# EAGLE design Electronic DC Load (EAGLE 8.3.2)
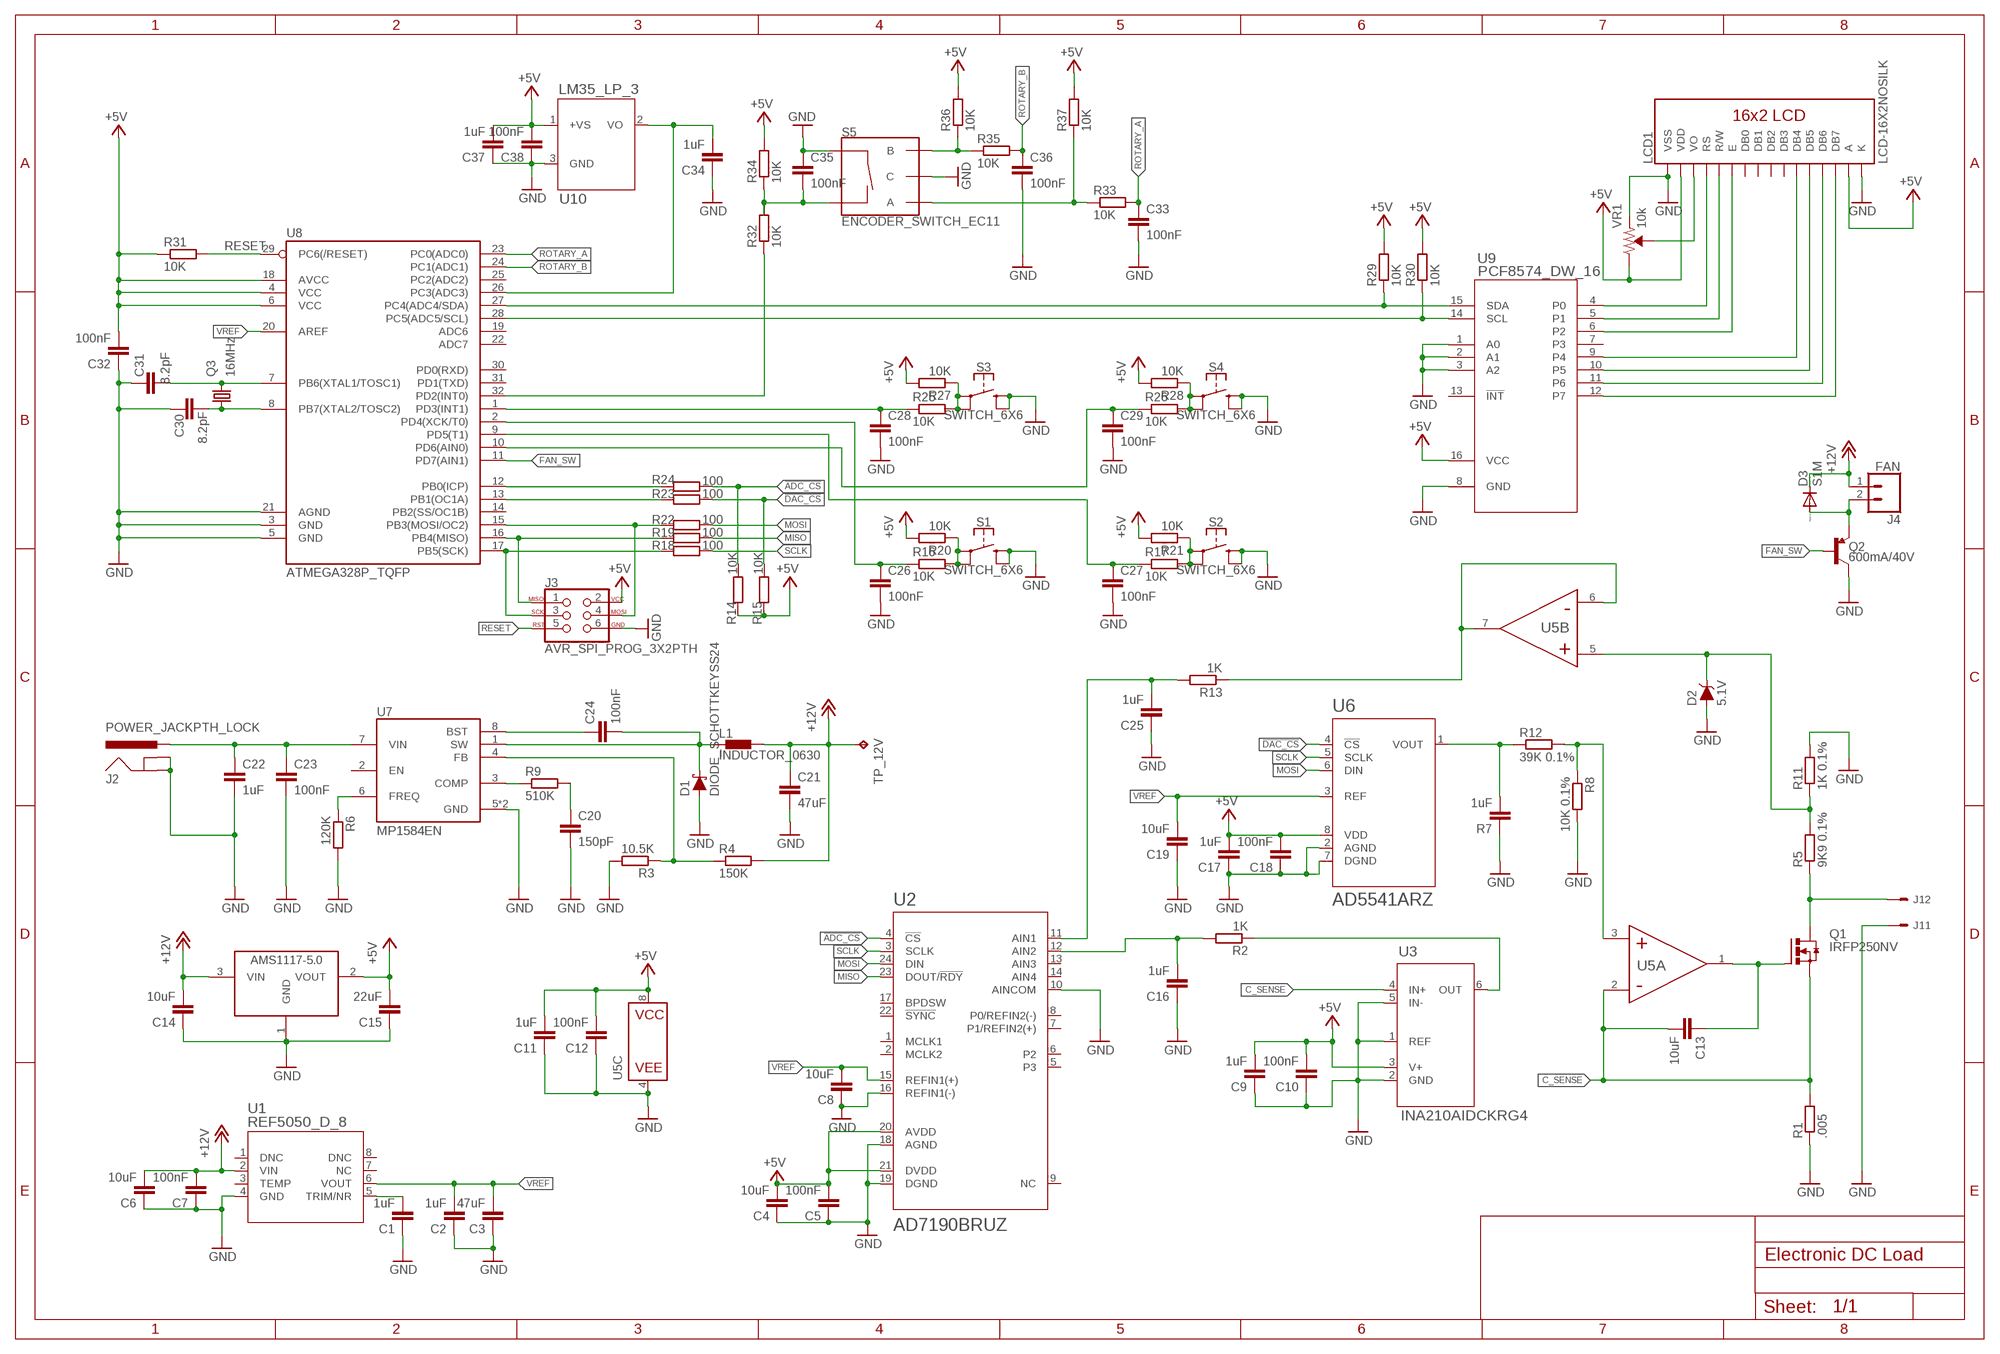
[diagram p0: schematic, sheet 1]

## Parts
C1  1uF  C-EUC0805  [C0805]
C2  1uF  C-EUC0805  [C0805]
C3  47uF  C-EUC1206  [C1206]
C4  10uF  C-EUC1206  [C1206]
C5  100nF  C-EUC0805  [C0805]
C6  10uF  C-EUC1206  [C1206]
C7  100nF  C-EUC0805  [C0805]
C8  10uF  C-EUC1206  [C1206]
C9  1uF  C-EUC0805  [C0805]
C10  100nF  C-EUC0805  [C0805]
C11  1uF  C-EUC0805  [C0805]
C12  100nF  C-EUC0805  [C0805]
C13  10uF  C-EUC1206  [C1206]
C14  10uF  C-EUC1206  [C1206]
C15  22uF  C-EUC1206  [C1206]
C16  1uF  C-EUC0805  [C0805]
C17  1uF  C-EUC0805  [C0805]
C18  100nF  C-EUC0805  [C0805]
C19  10uF  C-EUC1206  [C1206]
C20  150pF  C-EUC0402  [C0402]
C21  47uF  C-EUC1206  [C1206]
C22  1uF  C-EUC0805  [C0805]
C23  100nF  C-EUC0805  [C0805]
C24  100nF  C-EUC0805  [C0805]
C25  1uF  C-EUC0805  [C0805]
C26  100nF  C-EUC0603  [C0603]
C27  100nF  C-EUC0603  [C0603]
C28  100nF  C-EUC0603  [C0603]
C29  100nF  C-EUC0603  [C0603]
C30  8.2pF  C-EUC0603  [C0603]
C31  8.2pF  C-EUC0603  [C0603]
C32  100nF  C-EUC0603  [C0603]
C33  100nF  C-EUC0603  [C0603]
C34  1uF  C-EUC0805  [C0805]
C35  100nF  C-EUC0603  [C0603]
C36  100nF  C-EUC0603  [C0603]
C37  1uF  C-EUC0805  [C0805]
C38  100nF  C-EUC0805  [C0805]
D1  DIODE_SCHOTTKEYSS24  [SMA-DIODE]
D2  5.1V  DIODE-ZENER-ZMM5.1  [LL-34]
D3  S1M  [SMA]
J1  KF762-2  [KF762-2]
J2  POWER_JACKPTH_LOCK  [POWER_JACK_PTH_LOCK]
J3  AVR_SPI_PROG_3X2PTH  [2X3]
J4  FAN  CONN_02LOCK_LONGPADS  [1X02_LOCK_LONGPADS]
L1  INDUCTOR_0630  [INDUCTOR_0630]
LCD1  LCD-16X2NOSILK  [LCD-16X2_NOSILK]
Q1  IRFP250NV  [TO247BV]
Q2  600mA/40V  TRANS_PNP-MMBT4403  [SOT23-3]
Q3  16MHz  KX-7  [3.2X2.5_KX-7]
R1  .005  MRE_R005_4W_2728_1%  [2728]
R2  1K  R-EU_R0805  [R0805]
R3  10.5K  R-EU_R0603  [R0603]
R4  150K  R-EU_R0603  [R0603]
R5  9K9 0.1%  R-EU_M0805  [M0805]
R6  120K  R-EU_R0603  [R0603]
R7  1uF  C-EUC0805  [C0805]
R8  10K 0.1%  R-EU_R0805  [R0805]
R9  510K  R-EU_R0603  [R0603]
R11  1K 0.1%  R-EU_M0805  [M0805]
R12  39K 0.1%  R-EU_R0805  [R0805]
R13  1K  R-EU_R0805  [R0805]
R14  10K  R-EU_M0805  [M0805]
R15  10K  R-EU_M0805  [M0805]
R16  10K  R-EU_R0603  [R0603]
R17  10K  R-EU_R0603  [R0603]
R18  100  R-EU_M0805  [M0805]
R19  100  R-EU_M0805  [M0805]
R20  10K  R-EU_R0603  [R0603]
R21  10K  R-EU_R0603  [R0603]
R22  100  R-EU_M0805  [M0805]
R23  100  R-EU_M0805  [M0805]
R24  100  R-EU_M0805  [M0805]
R25  10K  R-EU_R0603  [R0603]
R26  10K  R-EU_R0603  [R0603]
R27  10K  R-EU_R0603  [R0603]
R28  10K  R-EU_R0603  [R0603]
R29  10K  R-EU_R0603  [R0603]
R30  10K  R-EU_R0603  [R0603]
R31  10K  R-EU_R0603  [R0603]
R32  10K  R-EU_R0603  [R0603]
R33  10K  R-EU_R0603  [R0603]
R34  10K  R-EU_R0603  [R0603]
R35  10K  R-EU_R0603  [R0603]
R36  10K  R-EU_R0603  [R0603]
R37  10K  R-EU_R0603  [R0603]
S1  SWITCH_6X6  [SWITCH_SMD_6MM]
S2  SWITCH_6X6  [SWITCH_SMD_6MM]
S3  SWITCH_6X6  [SWITCH_SMD_6MM]
S4  SWITCH_6X6  [SWITCH_SMD_6MM]
S5  ENCODER_SWITCH_EC11  [ROTARY_ENCODER_EC11]
TP_12V  TPB1,27  [B1,27]
U1  REF5050_D_8  [D8]
U2  AD7190BRUZ  [RU_24]
U3  INA210AIDCKRG4  [DCK0006A_N]
U4  AMS1117-5.0  [SOT223]
U5  AD8629ARZ  [R_8]
U6  AD5541ARZ  [R_8]
U7  MP1584EN  [SOIC9P127_490X600X170L84X42T330X241N]
U8  ATMEGA328P_TQFP  [TQFP32-08]
U9  PCF8574_DW_16  [DW16]
U10  LM35_LP_3  [Z03A]
VR1  10k  TRIMPOT-SMD-3MM-OPEN-1/10W-25%  [TRIMPOT-SMD-TC33X]

## Nets
!ADC_CS: R14.2 R24.2 U2.4(!CS)
!DAC_CS: R15.2 R23.2 U6.4(!CS)
+5V [sup]: C4.2 C5.2 C9.2 C10.2 C11.2 C12.2 C15.2 C17.2 C18.2 C32.2 C37.2 C38.2 J3.2 LCD1.2(VDD) LCD1.15(A) R14.1 R15.1 R20.2 R21.2 R27.2 R28.2 R29.2 R30.2 R31.1 R34.2 R36.2 R37.2 U2.20(AVDD) U2.21(DVDD) U3.3(V+) U4.2(VOUT) U5.8(C:VCC) U6.8(VDD) U8.4(VCC) U8.6(VCC) U8.18(AVCC) U9.16(VCC) U10.1(+VS) VR1.1(CW)
+12V: C6.2 C7.2 C14.2 C21.1 D3.C J4.1 L1.P$2 R4.2 TP_12V.TP U1.2(VIN) U4.3(VIN)
C_SENSE [discharge]: C13.2 Q1.S R1.2 U3.4(IN+) U5.2(A:IN-)
FAN_SW: Q2.1(B) U8.11(PD7(AIN1))
GND: C1.1 C2.1 C3.1 C4.1 C5.1 C6.1 C7.1 C8.1 C9.1 C10.1 C11.1 C12.1 C14.1 C15.1 C16.1 C17.1 C18.1 C19.1 C20.2 C21.2 C22.2 C23.2 C25.1 C26.2 C27.2 C28.2 C29.2 C30.1 C31.1 C32.1 C33.2 C34.1 C35.1 C36.2 C37.1 C38.1 D1.A D2.A J1.1 J2.GND J2.GNDBREAK J3.6 LCD1.1(VSS) LCD1.16(K) Q2.3(C) R1.1 R3.2 R6.2 R7.1 R8.2 R11.2 S1.B1 S1.B2 S2.B1 S2.B2 S3.B1 S3.B2 S4.B1 S4.B2 S5.C S5.D(SW+) U1.4(GND) U2.10(AINCOM) U2.16(REFIN1(-)) U2.18(AGND) U2.19(DGND) U3.1(REF) U3.2(GND) U3.5(IN-) U4.1(GND) U5.4(C:VEE) U6.2(AGND) U6.7(DGND) U7.5(GND) U7.9(GND) U8.3(GND) U8.5(GND) U8.21(AGND) U9.1(A0) U9.2(A1) U9.3(A2) U9.8(GND) U10.3(GND) VR1.3(CCW)
MISO: R19.2 U2.23(DOUT/!RDY)
MOSI: R22.2 U2.24(DIN) U6.6(DIN)
N$1: R29.1 U8.27(PC4(ADC4/SDA)) U9.15(SDA)
N$2: R30.1 U8.28(PC5(ADC5/SCL)) U9.14(SCL)
N$3: LCD1.11(DB4) U9.9(P4)
N$4: LCD1.12(DB5) U9.10(P5)
N$5: LCD1.13(DB6) U9.11(P6)
N$6: LCD1.14(DB7) U9.12(P7)
N$7: LCD1.4(RS) U9.4(P0)
N$8: LCD1.5(R/W) U9.5(P1)
N$9: LCD1.6(E) U9.6(P2)
N$10: C1.2 U1.5(TRIM/NR)
N$11: C31.2 Q3.3 U8.7(PB6(XTAL1/TOSC1))
N$12: C30.2 Q3.1 U8.8(PB7(XTAL2/TOSC2))
N$13: LCD1.3(VO) VR1.2(WIPER)
N$14 [discharge]: J1.2 Q1.D R5.1
N$15: C34.2 U8.26(PC3(ADC3)) U10.2(VO)
N$16: C25.2 R13.2 U2.11(AIN1)
N$17: R6.1 U7.6(FREQ)
N$18: R2.1 U3.6(OUT)
N$19: C24.1 U7.8(BST)
N$20: C22.1 C23.1 J2.PWR U7.7(VIN)
N$21: C24.2 D1.C L1.P$1 U7.1(SW)
N$22: R3.1 R4.1 U7.4(FB)
N$23: R9.1 U7.3(COMP)
N$24: C16.2 R2.2 U2.12(AIN2)
N$25: C20.1 R9.2
N$26: R7.2 R12.1 U6.1(VOUT)
N$27: R13.1 U5.6(B:IN-) U5.7(B:OUT)
N$28: D3.A J4.2 Q2.2(E)
N$29: R35.1 R36.1 S5.B
N$30: J3.3 R18.1 U8.17(PB5(SCK))
N$31: J3.1 R19.1 U8.16(PB4(MISO))
N$32: J3.4 R22.1 U8.15(PB3(MOSI/OC2))
N$34: R23.1 U8.13(PB1(OC1A))
N$35: R24.1 U8.12(PB0(ICP))
N$36: C13.1 Q1.G U5.1(A:OUT)
N$37: D2.C R5.2 R11.1 U5.5(B:IN+)
N$38: R33.1 R37.1 S5.A
N$39: R8.1 R12.2 U5.3(A:IN+)
N$40: R16.2 R20.1 S1.A1 S1.A2
N$41: R25.2 R27.1 S3.A1 S3.A2
N$42: C35.2 R32.2 R34.1 S5.E(SW-)
N$43: C26.1 R16.1 U8.2(PD4(XCK/T0))
N$44: R32.1 U8.32(PD2(INT0))
N$46: C28.1 R25.1 U8.1(PD3(INT1))
N$48: R26.2 R28.1 S4.A1 S4.A2
N$51: R17.2 R21.1 S2.A1 S2.A2
N$52: C27.1 R17.1 U8.9(PD5(T1))
N$55: C29.1 R26.1 U8.10(PD6(AIN0))
RESET: J3.5 R31.2 U8.29(PC6(/RESET))
ROTARY_A: C33.1 R33.2 U8.23(PC0(ADC0))
ROTARY_B: C36.1 R35.2 U8.24(PC1(ADC1))
SCLK: R18.2 U2.3(SCLK) U6.5(SCLK)
VREF [sup]: C2.2 C3.2 C8.2 C19.2 U1.6(VOUT) U2.15(REFIN1(+)) U6.3(REF) U8.20(AREF)
Unconnected: LCD1.7(DB0) LCD1.8(DB1) LCD1.9(DB2) LCD1.10(DB3) U1.1(DNC) U1.3(TEMP) U1.7(NC) U1.8(DNC) U2.1(MCLK1) U2.2(MCLK2) U2.5(P3) U2.6(P2) U2.7(P1/REFIN2(+)) U2.8(P0/REFIN2(-)) U2.9(NC) U2.13(AIN3) U2.14(AIN4) U2.17(BPDSW) U2.22(!SYNC) U7.2(EN) U8.14(PB2(SS/OC1B)) U8.19(ADC6) U8.22(ADC7) U8.25(PC2(ADC2)) U8.30(PD0(RXD)) U8.31(PD1(TXD)) U9.7(P3) U9.13(!INT)

## Library data of the parts
C1-C38 R7 = resistor:C-EU: CAPACITOR, European symbol
D1 = 0_discrete:DIODE_SCHOTTKEY
D2 = 0_discrete:DIODE-ZENER: Zener Diode A Zener diode allows current to flow from its anode to its cathode like a normal semiconductor diode, but it also permits current to flow in the reverse direction when its "Zener voltage" is reached. - WIkipedia
D3 = diode:S1M
J1 = 0_discrete:KF762-2
J2 = SparkFun-Connectors:POWER_JACK: Power Jack Connector This is the standard 5.5mm barrel jack for power. The PTH is the most common, proven, reliable, footprint. The Slot footprint only works if the mill layer is transmitted to the PCB fab house so be warned. Here are the connectors we sell at SparkFun: DC Barrel Power Jack/Connector (PRT-00119) DC Barrel Power Jack/Connector (SMD) (PRT-12748) DC Barrel Jack Adapter - Breadboard Compatible (PRT-10811) It is used on this SparkFun product (and many, many others): SparkFun RedBoard - Programmed with Arduino (DEV-12757) Also, if you need a mating power supply or connector, please check these out: Wall Adapter Power Supply - 9VDC 650mA (TOL-00298) DC Barrel Jack Adapter - Male (PRT-10287); PROD_ID: CONN-08197; SF_ID: PRT-00119
J3 = SparkFun-Connectors:AVR_SPI_PROG_3X2: AVR ISP 6 Pin This is the reduced ISP connector for AVR programming. Common on Arduino. This footprint will take up less PCB space and can be used with a 10-pin to 6-pin adapter such as SKU: BOB-08508 **Special note about "TEST_POINT" package. The stop mask is on the top side, so if you want your programming test points to be on the bottom of your board, make sure to place this package on the bottom side of the board. This also ensure that the orientation to program from the bottom side will be correct. SparkFun Products: SparkFun ISP Pogo Adapter - NS Tiny AVR Programmer -PTH
J4 = SparkFun-Connectors:CONN_02: Multi connection point. Often used as Generic Header-pin footprint for 0.1 inch spaced/style header connections On any of the 0.1 inch spaced packages, you can populate with these: Break Away Headers - Straight (PRT-00116) Break Away Male Headers - Right Angle (PRT-00553) Female Headers (PRT-00115) Break Away Headers - Machine Pin (PRT-00117) Break Away Female Headers - Swiss Machine Pin (PRT-00743) For SCREWTERMINALS and SPRING TERMINALS visit here: Screw Terimnals on SparkFun.com (5mm/3.5mm/2.54mm spacing) This device is also useful as a general connection point to wire up your design to another part of your project. Our various solder wires solder well into these plated through hole pads. Hook-Up Wire - Assortment (Stranded, 22 AWG) (PRT-11375) Hook-Up Wire - Assortment (Solid Core, 22 AWG) (PRT-11367) View the entire wire category on our website here Special notes: Molex polarized connector foot print use with: PRT-08233 with associated crimp pins and housings. 2.54_SCREWTERM for use with PRT-10571. 3.5mm Screw Terminal footprints for PRT-08084 5mm Screw Terminal footprints for use with PRT-08432
L1 = 0_discrete:INDUCTOR_0630
LCD1 = SparkFun-Displays:LCD-16X2: Standard text-only 16x2 parallel input LCD Basic 16 character by 2 line display. Typically utilizes the extremely common HD44780 parallel interface chipset SparkFun Products: Basic 16x2 Green Basic 8x2 Green; SF_ID: LCD-00255
Q1 = 0_discrete:IRFP250N
Q2 = SparkFun-DiscreteSemi:TRANS_PNP: PNP transistor Current controlled devices typically used to amplify current or used as a switch. SparkFun Products: SparkFun Serial Enabled 16x2 LCD - Red on Black <https://www.sparkfun.com/products/9068> SparkFun Logomatic <https://www.sparkfun.com/products/12772>; PROD_ID: TRANS-09245
Q3 = crystal-geyer_V1_0:KX: Quartz Crystals (MHz) SMD: KX - Serie Model Size l/w/h [mm] Frequency Range Frequency Stability Temp. Range [°C] Load Capacitance AECQ 200 availabel Datasheet KX-4 KX-5 KX-6 KX-7 KX-9A KX-9B KX-12A KX-12B KX-13 KX-20 KX-K KX-KS 1.6/1.2/0.3 2.0/1.6/0.45 2.5/2.0/0.55 3.2/2.5/0.8 5.0/3.2/1.0 5.0/3.2/1.1 6.0/3.5/1.1 6.0/3.5/1.0 7.0/5.0 /1.3 11.6/5.5/1.6 12.3/4.5/4.2 12.3/4.5/3.2 24.0 ~ 80.0 MHz 16.0 ~ 80.0 MHz 12.0 ~ 80.0 MHz 8.0 ~ 60.0 MHz 7,68 ~ 300,0 MHz 8,0 ~ 50,0 MHz 8,0 ~ 150,0 MHz 8,0 ~ 50,0 MHz 6,0 ~ 160,0 MHz 3,579 ~ 25,0 MHz 3,579 ~ 70,0 MHz 3,579 ~ 70,0 MHz ±10 … ±50ppm ±10 … ±50ppm ±10 … ±50ppm ±10 … ±50ppm ±10 … ±50ppm ±10 … ±50ppm ±10 … ±50ppm ±10 … ±50ppm ±10 … ±50ppm ±50ppm ±10 … ±50ppm ±10 … ±50ppm (*) -40°C …+85°C (*) -40°C …+125°C (*) -40°C …+125°C (*) -40°C …+125°C (*) -40°C …+105°C (*) -40°C …+105°C (*) -40°C …+125°C (*) -40°C …+105°C (*) -40°C …+105°C (*) -40°C …+105°C (*) -40°C …+85°C (*) -40°C …+85°C 8, 8…16 8, 8…16 10, 8…16 12, 7…20 16, 10…20 16, 10…20 16, 10…20 16, 12…20 16, 12…20 16, 12…20 16, 12…30 16, 12…30 - yes yes yes - - - - - - - - KX-4.pdf KX-5.pdf KX-6.pdf KX-7.pdf KX-9A.pdf KX-9B.pdf KX-12A.pdf KX-12B.pdf KX-13.pdf KX-20.pdf KX-K.pdf KX-KS.pdf Details see: http://www.geyer-electronic.de/Frequenz-Produkte.9.0.html Created 2016-06-07, Hans Locher 2016 (C) Geyer Quartz Technology KX4,KX5,KX6,KX7,KX9A,KX9B,KX12A,KX12B,KX13,KX20,KXK,KXKS;1612;2016;2520;3225;5032;6035;7050;11655;12345;1,6x1,2;2,0x1,6;2,5x2,0;3,2x2,5;5,0x3,2;6,0x3,5;7,0x5,0;11,6x5,5;12,3x4,5;12,3x4,5;1.6x1.2;2.0x1.6;2.5x2.0;3.2x2.5;5.0x3.2;6.0x3.5;7.0x5.0;11.6x5.5;12.3x4.5;12.3x4.5;
R1 = 0_sup:MRE_R005_4W_2728_1%: Meta Alloy Low-Resistance Resistor
R2-R6 R8 R9 R11-R37 = resistor:R-EU_: RESISTOR, European symbol
S1-S4 = 0_discrete:SWITCH_6X6
S5 = 0_discrete:ENCODER_SWITCH_EC11
TP_12V = testpad:TP: Test pad
U1 = 0_texas-instrument:REF5050_D_8; DATASHEETURL: httpwww.ti.comlitgpnREF5050; FAMILY_NAME: SERIES VOLTAGE REFERENCE; GENERIC_PART_NUMBER: REF5050; INDUSTRY_STD_PKG_TYPE: SOIC; MANUFACTURER: Texas Instruments; MANUFACTURER_PART_NUMBER: ref5050_d_8; PACKAGE_DESIGNATOR: D; PIN_COUNT: 8; VENDOR: Texas Instruments
U2 = 0_analog-devices:AD7190BRUZ; MANUFACTURER_PART_NUMBER: AD7190BRUZREEL; VENDOR: Vendor
U3 = 0_texas-instrument:INA210AIDCKRG4; ALTERNATEPARTNUMBER: INA210AIDCKT; APPLICATION_BUILDNUMBER: *; COMPTYPE: IC; MANUFACTURER: Texas Instruments; MOUNTTYPE: SMT; PACKAGEREFERENCE: DCK0006A; PARTNUMBER: INA210AIDCKR; PIN_COUNT: 6; REFDES: RefDes; ROHS: Y; TYPE: TYPE
U4 = AMS1117-5.0:AMS1117-5.0; AVAILABILITY: Unavailable; DESCRIPTION: Sot-223; MF: ams; MP: AMS1117-5.0; PACKAGE: SOT-223 ams; PRICE: 0.09 USD
U5 = 0_analog-devices:AD8629ARZ
U6 = 0_analog-devices:AD5541ARZ; MANUFACTURER_PART_NUMBER: AD5541ARZ; VENDOR: Vendor
U7 = MP1584EN:MP1584EN: 3A, 1.5MHz, 28V Step-Down Converter; AVAILABILITY: Unavailable; MF: Monolithic Power Systems; MP: MP1584EN; PACKAGE: None; PRICE: None
U8 = SparkFun-IC-Microcontroller:ATMEGA328P_TQFP: Popular 328P in QFP Storefront component: ATmega328 - TQFP (COM-13448) Datasheet SparkFun Products SparkFun RedBoard - Programmed with Arduino (DEV-12757) Arduino Pro Mini 328 - 5V/16MHz (DEV-11113) Arduino Pro Mini 328 - 3.3V/8MHz (DEV-11114) SparkFun OpenLog (DEV-13712) SparkFun MicroView - OLED Arduino Module (DEV-12923) SparkFun Digital Sandbox (DEV-12651) SparkFun PicoBoard (WIG-11888) Arduino Fio (DEV-10116) LilyPad Arduino 328 Main Board (DEV-13342) SparkFun RedStick (DEV-13741) LilyPad MP3 (DEV-11013) LilyPad Arduino SimpleSnap (DEV-10941) SparkFun Stepoko (ROB-13899) SparkFun Geiger Counter (SEN-11345) SparkFun EL Sequencer (COM-12781) Arduino Pro 328 - 5V/16MHz (DEV-10915) CryptoCape (DEV-12773) SparkFun IR Thermometer Evaluation Board - MLX90614 (SEN-10740) SparkFun RedBot Mainboard (ROB-12097) Arduino Pro 328 - 3.3V/8MHz (DEV-10914) SparkFun Block for Intel® Edison - Arduino (DEV-13036) SparkFun Simon Says - Surface Mount Soldering Kit (KIT-10935) SparkFun 7-Segment Serial Display - Red (COM-11441) SparkFun 7-Segment Serial Display - White (COM-11629) SparkFun 7-Segment Serial Display - Yellow (COM-11443) SparkFun 7-Segment Serial Display - Kelly Green (COM-11440) SparkFun 7-Segment Serial Display - Blue (COM-11442) SparkFun OpenSegment Serial Display - 20mm (Blue) (COM-11647) SparkFun OpenSegment Serial Display - 20mm (Green) (COM-11646) SparkFun OpenSegment Serial Display - 20mm (White) (COM-11648) SparkFun OpenSegment Serial Display - 20mm (Red) (COM-11644) SparkFun OpenSegment Serial Display - 20mm (Yellow) (COM-11645) SparkFun OpenSegment Shield (DEV-13190); PROD_ID: IC-09069
U9 = 0_texas-instrument:PCF8574_DW_16; MANUFACTURER_PART_NUMBER: pcf8574_dw_16; VENDOR: Texas Instruments
U10 = 0_texas-instrument:LM35_LP_3; VENDOR: NationalSemiconductor
VR1 = SparkFun-Resistors:TRIMPOT: Trimming Potentiometer (Trimpot) Three-terminal potentiometers, with an adjustable wiper and two adjustable resistors. A pot can be used to create a configurable voltage divider, or as a variable resistor. "Trimpots" are a subset of potentiometers, usually intended for "set-and-forget" applications. They're often more delicate than standard potentiometers - rated for fewer turns. Variants PTH-KNOB - PTH Trimpot w/ finger-adjustable knob Trimpot 10K with Knob (COM-09806) Datasheet SMD-3MM-CLOSED-FRAME - SMD 3mm Square Closed-Frame Trimpot Used on e.g. EasyDriver - Stepper Motor Driver Datasheet (22AR10KTR) SMD-5MM - SMD 5mm Square Closed-Frame Trimpot Used on e.g. IOIO-OTG - V2.2 Datasheet (TS53YL502MR10) SMD-3MM-1/10W-25% - 3mm Square Open-Frame Trimpot Used on e.g. SparkFun Shapeoko Datasheet (TC33X-2-103E); PROD_ID: RES-12428

## Net classes
1 discharge: clearance 0.1 mm

## Board
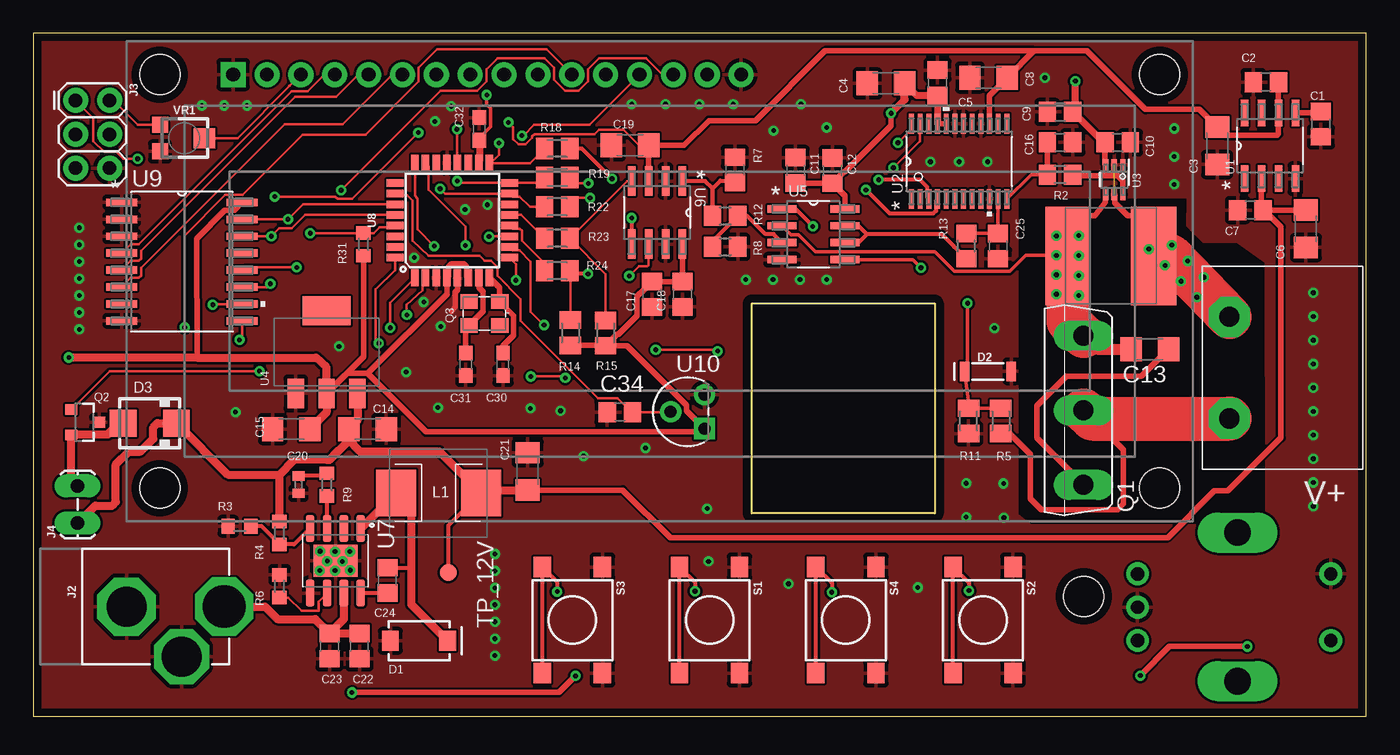
[diagram p1: board, top side]
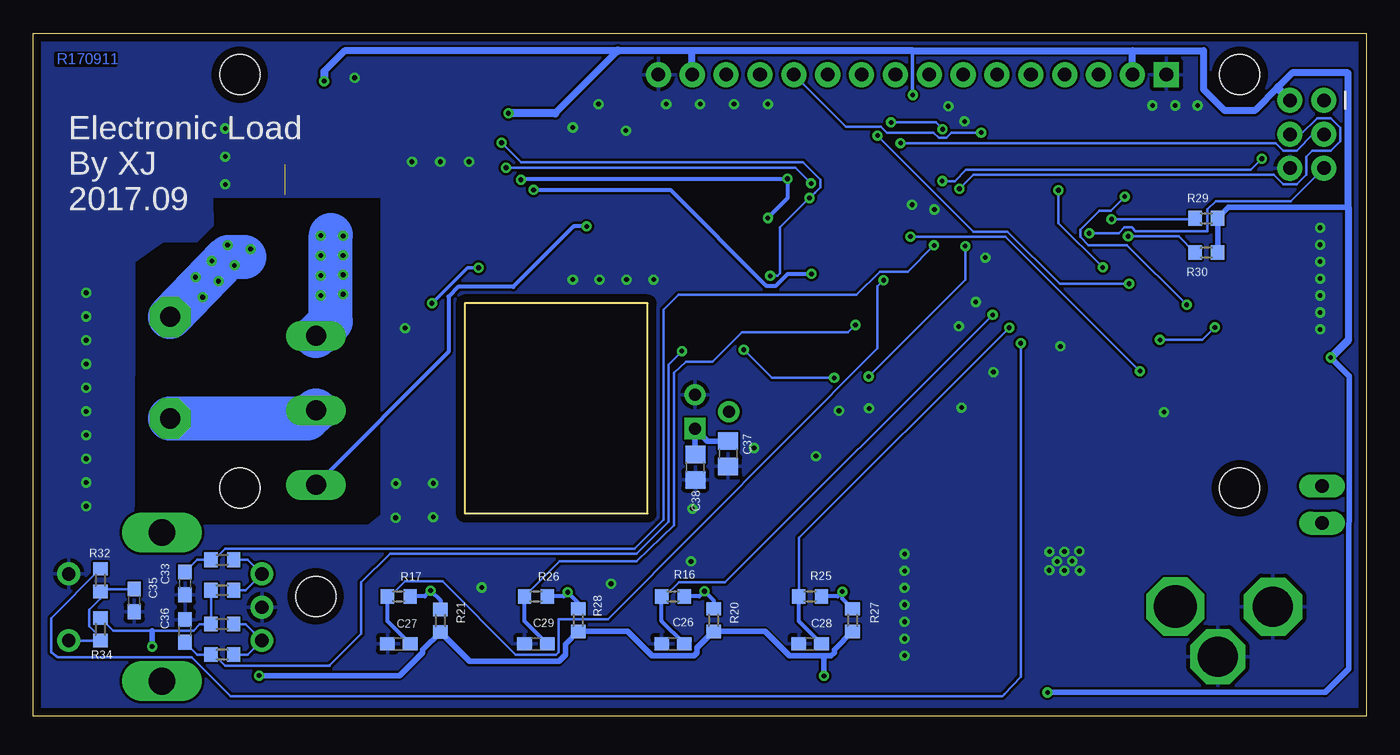
[diagram p2: board, bottom side, seen from below]

Size 99.97 x 51.21 mm. Coordinates in mm from the lower left corner, seen from the top.
Outline: 0,0 99.97,0 99.97,51.21 0,51.21 0,0
Outline: 53.9,30.96 67.61,30.96 67.61,15.21 53.9,15.21 53.9,30.96
Copper layers (1*16): Top 0.035mm / dielectric 1.5mm / Bottom 0.035mm
Design rules "SZ-JLC": minimum track width 7mil, minimum drill 0.35mm, track to track 7mil, track to pad 7mil, pad to pad 7mil, via to via 7mil, smd to smd 6mil, copper to edge 0.6mm, drill to drill 10mil, minimum pad ring 14mil, minimum via ring 8mil, stop-mask expansion 4mil, vias tented up to drill 38mil, thermal gap 0.3mm
Holes 3 mm at 78.79,8.99
bKeepout: area 26.7,12.6 to 34.3,20.2

### Footprints (pad centres in the part's own frame; a part is rotated, then mirrored left to right if it is on the bottom)
C0805 = smd 1.3 x 1.5: 1 -0.95,0; 2 0.95,0
C1206 = smd 1.6 x 1.8: 1 -1.4,0; 2 1.4,0
C0402 = smd 0.7 x 0.9: 1 -0.65,0; 2 0.65,0
C0603 = smd 1.1 x 1: 1 -0.85,0; 2 0.85,0
SMA-DIODE = smd 1.27 x 1.47: A -2.15,0; C 2.15,0
LL-34 = smd 0.7 x 1.46: A 2,0; C -1.5,0
SMA = smd 2 x 2: A 2,0; C -2,0
KF762-2 = drill 1.5 pad 3.048 octagon: 1 -3.81,0; 2 3.81,0
POWER_JACK_PTH_LOCK = drill 2.997 pad 4.369 octagon: GND 0.025,6.557 | drill 2.997 pad 4.115 octagon: GNDBREAK 3.762,10.7 | drill 3.2 pad 4.369 octagon: PWR 0,13.878
2X3 = drill 1.016 pad 1.88: 1 0,0; 2 0,2.54; 3 2.54,0; 4 2.54,2.54; 5 5.08,0; 6 5.08,2.54
1X02_LOCK_LONGPADS = drill 1.016 long: 1 -0.127,0; 2 2.667,0
INDUCTOR_0630 = smd 3 x 3.5: P$1 -3.183,-0.002; P$2 3.167,-0.002
LCD-16X2_NOSILK = drill 1.016 pad 1.88 square: 1 -32,15.5 | drill 1.016 pad 1.88: 2 -29.46,15.5; 3 -26.92,15.5; 4 -24.38,15.5; 5 -21.84,15.5; 6 -19.3,15.5; 7 -16.76,15.5; 8 -14.22,15.5; 9 -11.68,15.5; 10 -9.14,15.5; 11 -6.6,15.5; 12 -4.06,15.5; 13 -1.52,15.5; 14 1.02,15.5; 15 3.56,15.5; 16 6.1,15.5 | hole 3: -37.5,15.5; -37.5,-15.5; 37.5,15.5; 37.5,-15.5
TO247BV = drill 1.499 long: D 0,-2.921; G -5.588,-2.921; S 5.588,-2.921
SOT23-3 = smd 0.8 x 0.9: 1 -0.95,-1; 2 0.95,-1; 3 0,1.1
3.2X2.5_KX-7 = smd 1.3 x 1.1: 1 -1.15,-0.9; 2 1.15,-0.9; 3 1.15,0.9; 4 -1.15,0.9
2728 = smd 3.4 x 7.4: 1 -3.2,0; 2 3.2,0
R0805 = smd 1.3 x 1.5: 1 -0.95,0; 2 0.95,0
R0603 = smd 1 x 1.1: 1 -0.85,0; 2 0.85,0
M0805 = smd 1.3 x 1.6: 1 -0.95,0; 2 0.95,0
SWITCH_SMD_6MM = smd 1.55 x 1.3: A1 -3.975,-2.25; A2 3.975,-2.25; B1 -3.975,2.25; B2 3.975,2.25
ROTARY_ENCODER_EC11 = drill 1: A -2.5,-7.55; B 2.5,-7.55; C 0,-7.55; D -2.5,6.95; E 2.5,6.95 | drill 2 long: HOLDER_1 -5.6,-0.05; HOLDER_2 5.55,-0.05
B1,27 = smd 1.27 x 1.27: TP 0,0
D8 = smd 1.981 x 0.559: 1 -2.464,1.905; 2 -2.464,0.635; 3 -2.464,-0.635; 4 -2.464,-1.905; 5 2.464,-1.905; 6 2.464,-0.635; 7 2.464,0.635; 8 2.464,1.905
RU_24 = smd 1.473 x 0.356: 1 -2.819,3.575; 2 -2.819,2.925; 3 -2.819,2.275; 4 -2.819,1.625; 5 -2.819,0.975; 6 -2.819,0.325; 7 -2.819,-0.325; 8 -2.819,-0.975; 9 -2.819,-1.625; 10 -2.819,-2.275; 11 -2.819,-2.925; 12 -2.819,-3.575; 13 2.819,-3.575; 14 2.819,-2.925; 15 2.819,-2.275; 16 2.819,-1.625; 17 2.819,-0.975; 18 2.819,-0.325; 19 2.819,0.325; 20 2.819,0.975; 21 2.819,1.625; 22 2.819,2.275; 23 2.819,2.925; 24 2.819,3.575
DCK0006A_N = smd 0.85 x 0.4: 1 -1.125,0.65; 2 -1.125,0; 3 -1.125,-0.65; 4 1.125,-0.65; 5 1.125,0; 6 1.125,0.65
SOT223 = smd 2.235 x 1.219: 1 -3.099,2.311; 2 -3.099,0; 3 -3.099,-2.311 | smd 2.2 x 3.6: 4 3.099,0
R_8 = smd 2.184 x 0.559: 1 -2.362,1.905; 2 -2.362,0.635; 3 -2.362,-0.635; 4 -2.362,-1.905; 5 2.362,-1.905; 6 2.362,-0.635; 7 2.362,0.635; 8 2.362,1.905
SOIC9P127_490X600X170L84X42T330X241N = smd 2.05 x 0.66: 1 -2.43,1.905; 2 -2.43,0.635; 3 -2.43,-0.635; 4 -2.43,-1.905; 5 2.43,-1.905; 6 2.43,-0.635; 7 2.43,0.635; 8 2.43,1.905 | smd 2.41 x 3.3: 9 0,0
TQFP32-08 = smd 1.27 x 0.559: 1 -4.293,2.8; 2 -4.293,2; 3 -4.293,1.2; 4 -4.293,0.4; 5 -4.293,-0.4; 6 -4.293,-1.2; 7 -4.293,-2; 8 -4.293,-2.8; 17 4.293,-2.8; 18 4.293,-2; 19 4.293,-1.2; 20 4.293,-0.4; 21 4.293,0.4; 22 4.293,1.2; 23 4.293,2; 24 4.293,2.8 | smd 0.559 x 1.27: 9 -2.8,-4.293; 10 -2,-4.293; 11 -1.2,-4.293; 12 -0.4,-4.293; 13 0.4,-4.293; 14 1.2,-4.293; 15 2,-4.293; 16 2.8,-4.293; 25 2.8,4.293; 26 2,4.293; 27 1.2,4.293; 28 0.4,4.293; 29 -0.4,4.293; 30 -1.2,4.293; 31 -2,4.293; 32 -2.8,4.293
DW16 = smd 2.311 x 0.559: 1 -4.521,4.445; 2 -4.521,3.175; 3 -4.521,1.905; 4 -4.521,0.635; 5 -4.521,-0.635; 6 -4.521,-1.905; 7 -4.521,-3.175; 8 -4.521,-4.445; 9 4.521,-4.445; 10 4.521,-3.175; 11 4.521,-1.905; 12 4.521,-0.635; 13 4.521,0.635; 14 4.521,1.905; 15 4.521,3.175; 16 4.521,4.445
Z03A = drill 0.889 pad 1.397 square: 1 -2.54,-2.54 | drill 0.889 pad 1.397: 2 -1.27,0; 3 0,-2.54
TRIMPOT-SMD-TC33X = smd 1.2 x 1.2: 1 -1,-1.825; 3 1,-1.825 | smd 1.5 x 1.6: 2 0,1.5

### Placement (x,y rotation side)
C1  96.57,44.4 90 top
C2  92.46,47.55 0 top
C3  88.8,42.77 90 top
C4  63.96,47.45 0 top
C5  67.82,47.5 270 top
C6  95.45,36.55 90 top
C7  91.29,37.95 0 top
C8  71.65,47.88 0 top
C9  77.01,45.31 0 top
C10  81.33,43.03 180 top
C11  57.18,40.94 270 top
C12  59.94,40.92 270 top
C13  83.74,27.53 180 top
C14  25.07,21.54 180 top
C15  19.35,21.54 0 top
C16  77.01,43.03 180 top
C17  46.41,31.65 90 top
C18  48.69,31.65 90 top
C19  44.75,42.8 0 top
C20  19.89,17.37 270 top
C21  37.08,18.36 90 top
C22  24.46,5.26 270 top
C23  22.23,5.26 270 top
C24  26.57,10.19 90 top
C25  72.36,35.26 90 top
C26  51.99,5.44 180 bottom
C27  72.57,5.44 180 bottom
C28  41.71,5.44 180 bottom
C29  62.28,5.44 180 bottom
C30  35.23,26.39 90 top
C31  32.44,26.39 90 top
C32  33.45,44.04 270 top
C33  88.6,9.96 270 bottom
C34  43.99,22.81 0 top
C35  92.41,8.69 90 bottom
C36  88.6,6.4 90 bottom
C37  47.85,19.68 90 bottom
C38  50.32,18.67 90 bottom
D1  28.93,5.66 0 top
D2  71.35,25.86 0 top
D3  8.74,21.97 180 top
J1  89.71,26.14 270 top
J2  0.43,8.23 270 top
J3  3.17,46.18 270 top
J4  3.33,14.61 90 top
L1  30.4,16.74 0 top
LCD1  46.99,32.61 0 top
Q1  75.84,22.94 90 top
Q2  3.84,22.05 270 top
Q3  33.83,30.2 180 top
R1  80.82,34.52 180 top
R2  77.01,40.61 180 top
R3  15.47,14.25 180 top
R4  18.47,13.74 90 top
R5  72.57,22.15 90 top
R6  18.47,9.75 90 top
R7  52.63,40.97 270 top
R8  51.89,35.2 0 top
R9  22.02,17.37 90 top
R11  70.15,22.15 270 top
R12  51.89,37.52 0 top
R13  69.98,35.26 90 top
R14  40.28,28.75 90 top
R15  42.93,28.73 90 top
R16  51.99,8.99 0 bottom
R17  72.57,8.99 0 bottom
R18  39.29,42.57 0 top
R19  39.29,40.39 0 top
R20  48.95,7.21 270 bottom
R21  69.44,7.16 270 bottom
R22  39.29,38.2 0 top
R23  39.29,35.84 0 top
R24  39.29,33.4 0 top
R25  41.71,8.99 0 bottom
R26  62.28,8.99 0 bottom
R27  38.53,7.21 270 bottom
R28  59.11,7.21 270 bottom
R29  11.99,37.34 0 bottom
R30  11.99,34.77 0 bottom
R31  24.77,35.38 90 top
R32  94.95,10.21 270 bottom
R33  85.8,11.73 180 bottom
R34  94.95,6.53 90 bottom
R35  85.8,4.62 180 bottom
R36  85.8,6.91 180 bottom
R37  85.8,9.45 180 bottom
S1  50.72,7.21 270 top
S2  71.23,7.21 270 top
S3  40.44,7.21 270 top
S4  60.95,7.21 270 top
S5  90.37,8.18 270 top
TP_12V  31.11,10.77 0 top
U1  92.76,42.77 90 top
U2  69.44,41.61 90 top
U3  81.08,40.23 270 top
U4  22,27.3 90 top
U5  58.52,36.14 0 top
U6  46.79,37.77 270 top
U7  22.66,11.66 270 top
U8  31.42,37.19 90 top
U9  11.15,34.09 0 top
U10  47.8,24.1 90 top
VR1  11.33,43.36 270 top

### Tracks (layer width: path | path; a pad name or v marks a point on that pad's centre or on a via)
!ADC_CS  (via drill 0.35)
  Top 0.203: R14.2 40.28,33.25 40.34,33.3
  Top 0.305: U2.4 67.7,38.67 67.7,37.9 67.49,37.69 64.24,37.69 v62.46,39.47 | v41.6,33.17 40.47,33.17 40.34,33.3 R24.2
  Bottom 0.305: v41.6,33.17 43.37,33.17 44.26,32.29 45.01,32.29 52.19,39.47 v62.46,39.47
!DAC_CS
  Top 0.203: U6.4 44.54,40.13 R23.2 42.93,33.16 R15.2
+5V  (via drill 0.35)
  Top 0.203: VR1.1 7.81,44.36 5.99,46.18
  Top 0.254: U8.18 33.61,41.67 33.61,43.53 34.28,44.21 34.28,45.58 34.01,45.85 v34.01,46.58
  Top 0.406: U3.3 80.38,41.41 C10.2 80.25,43.03 | 78.11,45.17 C9.2 | C12.2 60.88,39.03 U5.8 | C11.2 57.2,39.97 C12.2 | U6.8 C18.2 C17.2 45.54,31.73 45.5,31.73 45.27,31.51 45.27,30.04 43.88,28.65 43.8,28.65 R15.1 | U8.18 33.45,41.51 C32.2 | C5.2 | U2.21 U2.20 | U8.6 32.51,33.01 32.51,33.7 32.27,33.93 31.37,33.93 31.13,33.7 31.13,33.01 U8.4 31.02,31.65 25.07,25.7 | U9.16 15.09,37.95 14.35,37.95 12.27,35.79 12.29,26.9 | R14.1 42.9,27.8 R15.1 | C12.2 60.79,40.81 60.86,40.81 64.34,44.29 v64.34,45.21 | 5.99,46.18 J3.2 | v83.03,3.05 85.22,5.23 v91.06,5.23 | 25.07,25.7 23.54,25.7 22.04,24.21 U4.2 | 25.07,25.7 29.46,21.32 50.1,21.32 U10.1 48.98,22.92 48.98,23.32 44.53,27.78 R15.1 | R31.1 24.77,26.98 21.96,24.17 | v23.9,1.78 39.43,1.78 v40.66,3.02
  Top 0.508: 80.25,43.03 78.11,45.17 78.11,47.58 | C4.2 66.26,46.55 C5.2 | C5.2 U2.21 | v64.34,45.21 65.36,46.23
  Top 0.61: 21.96,24.17 U4.2 | U4.2 22,26.16 21.21,26.9 12.29,26.9 v2.67,26.9 | 65.36,46.23 C4.2 | v78.16,47.62 78.11,47.58 | U4.2 22,22.78 C15.2
  Bottom 0.203: R37.2 R36.2 87.49,6.91 87.93,6.4 91.06,6.4 93.99,6.4 R34.2
  Bottom 0.254: 34.04,49.9 34.04,48.64 34.04,46.61 v34.01,46.58
  Bottom 0.406: 1.36,38.15 10.33,38.15 R29.2 R30.2 | 40.82,4.53 43.27,4.53 45.11,6.36 R20.2 50.19,5.12 50.19,4.77 50.42,4.53 53.56,4.53 55.4,6.36 R28.2 60.07,5.4 60.07,4.6 60.54,4.12 67.25,4.12 R21.2 70.79,4.97 70.79,4.78 72.52,3.05 v83.03,3.05 | 40.82,4.53 40.14,4.53 39.9,4.77 39.9,5 R27.2 | v91.06,5.23 91.06,6.4 | v2.67,26.9 1.28,25.51 1.3,3.56 3.07,1.78 v23.9,1.78 | v40.66,3.02 40.66,4.38 40.82,4.53 | C38.2 50.34,19.64 U10.1 49.41,20.64 C37.2
  Bottom 0.508: 1.36,28.21 1.36,38.15 1.36,48.23 5.54,48.23 6.59,47.18 8.37,45.41 10.61,45.41 12.2,46.99 12.2,49.9 17.53,49.9 | 17.53,49.9 34.04,49.9 50.57,49.9 | 50.57,49.9 56.13,49.9 | 60.82,45.21 56.15,49.89 76.63,49.89 78.16,48.36 | 50.57,48.13 50.57,49.9 | LCD1.2 17.53,49.9
  Bottom 0.61: 1.36,28.21 v2.67,26.9 | 60.82,45.21 v64.34,45.21 | 56.13,49.9 56.15,49.89 | 78.16,48.36 v78.16,47.62 | LCD1.15 50.57,48.13 | LCD1.2 | J3.2 6.59,47.06 6.59,47.18
+12V
  Top 0.305: L1.P$2 31.11,14.28 TP_12V.TP
  Top 0.406: C6.2 C7.2 92.13,37.96 92.13,38.15 | 92.13,38.15 U1.2 | C21.1 44.2,16.96 47.78,13.39 85.09,13.39 88.59,16.89 89.59,16.89 93.57,20.88 93.57,36.7 92.13,38.15 | 22.96,19.97 22.8,19.97 22.07,19.23
  Top 0.61: C21.1 33.8,16.96 L1.P$2 30.47,19.84 24.51,19.84 23.67,20.68 | 18.47,18.12 19.58,19.23 22.07,19.23 22.22,19.23 23.67,20.68 | R4.2 18.47,18.12 | J4.1 4.65,15.8 5.94,15.8 6.2,16.05 6.2,18.9 7.14,19.84 8.03,19.84 8.99,20.8 8.99,21.67 9.3,21.97 D3.C 14.59,18.12 18.47,18.12 | U4.3 24.31,22.18 C14.2 23.67,20.68
C_SENSE
  Top 0.254: U5.2 56.84,36.09 57.38,36.09 58.65,34.82 67.63,34.82 69.1,33.35 73.24,33.35 74.46,34.57 77.67,34.57
  Top 0.406: U3.4 80.43,38.54 79.63,37.54 77.98,37.54 77.88,37.64 | 77.88,37.64 77.72,37.49 | R1.2 77.67,34.57 77.88,34.77 77.88,37.64
  Top 0.813: Q1.S 79.81,27.53 C13.2
  Top 3.302: Q1.S 77.67,29.62 77.67,34.57
  Bottom 3.302: Q1.S 77.67,29.62 77.67,36.09
FAN_SW  (via drill 0.35)
  Top 0.203: Q2.1 5.72,25.88 v16.97,25.88 | v34.19,35.97 34.21,35.99 U8.11
  Bottom 0.203: v16.97,25.88 27.05,35.97 v34.19,35.97
GND  (via drill 0.35)  (1 unrouted)
  Top 0.406: U3.5 81.12,39.06 81.12,38.52 82.09,37.54 83.92,37.54 84.02,37.44 R1.1 | U8.5 31.82,31.98 31.65,31.81 31.65,30.66 31.37,30.38
  Top 3.302: J1.1 85.27,34.52 R1.1
  Bottom 3.302: J1.1 85.34,34.44 84.15,34.44
  other vias: 14.33,45.8 30.12,44.6 34.06,38.35 30.56,29.24 22.94,27.74 27.97,25.81 37.29,23.09 41.27,19.51 30.35,23.14 50.65,11.61 75.87,47.88 57.58,45.9 55.52,43.92 59.51,44.15 31.34,45.75 32.38,38 56.64,9.93 66.34,9.65 15.16,22.81 50.55,15.57 45.92,20.12 69.98,17.48 72.77,17.45 69.98,14.94 72.8,14.88 72.09,29.11 39.55,22.91 52.5,45.9 49.96,45.9 47.42,45.9 44.88,45.9 16.03,45.8 12.65,45.8 3.45,36.63 3.45,35.36 3.45,34.09 3.45,32.82 3.45,31.55 3.45,30.28 3.45,29.01 96.01,31.75 96.01,29.97 96.01,28.19 96.01,26.42 96.01,24.64 96.01,22.86 96.01,21.08 96.01,19.3 96.01,17.53 96.01,15.75 34.62,12.17 34.62,10.9 34.62,9.63 34.62,8.36 34.62,7.09 34.62,5.82 34.62,4.55 85.57,44.07 85.57,41.96 85.57,39.88 67.28,41.58 69.44,41.58 71.58,41.58 53.44,32.74 55.47,32.74 57.51,32.74 59.51,32.74 21.51,12.37 22.63,12.34 23.75,12.34 22.05,11.63 23.19,11.61 21.49,10.92 22.63,10.92 23.77,10.95 29.29,31.06 28.57,34.39
  pour Top: 0.05,51.16 99.85,51.16 99.95,-0.33 -0.1,-0.3
  pour Bottom: 0.05,51.16 99.85,51.16 99.95,-0.3 -0.08,-0.3
MISO  (via drill 0.35)
  Top 0.203: R19.2 40.68,39.95 v41.63,39.95 | v64.52,41.12 66.52,43.12 U2.23
  Bottom 0.203: v41.63,39.95 42.8,41.12 v64.52,41.12
MOSI  (via drill 0.35)
  Top 0.203: R22.2 40.9,38.86 v41.76,38.86 | v44.7,33.02 45.41,33.73 46.05,33.73 46.15,33.83 U6.6 | v64.85,43 65.87,44.02 U2.24
  Bottom 0.203: v44.7,33.02 44.17,33.02 43.97,33.22 43.97,36.65 v41.76,38.86 41.35,39.27 | 41.35,39.27 40.95,39.67 40.95,40.24 42.24,41.53 63.37,41.53 v64.85,43 | 41.35,39.27
N$1  (via drill 0.35)
  Top 0.203: U9.15 v19.1,37.26 20.23,38.39 U8.27
  Bottom 0.203: R29.1 12.91,37.26 v19.1,37.26
N$2  (via drill 0.35)
  Top 0.203: U9.14 v17.86,35.99 18.44,36.58 19.38,36.58 20.39,37.59 U8.28
  Bottom 0.203: R30.1 14.06,35.99 v17.86,35.99
N$3  (via drill 0.35)
  Top 0.203: LCD1.11 38.49,50.01 30.3,50.01 28.91,48.62 28.91,47.61 24.91,43.61 20.22,43.61 15.7,39.09 14.4,39.09 11.35,36.04 v11.35,29.16 | v15.47,28.22 15.67,28.42 U9.9
  Bottom 0.203: v11.35,29.16 12.29,28.22 v15.47,28.22
N$4  (via drill 0.35)
  Top 0.203: v18.11,38.96 22.64,38.96 22.82,38.79 23.9,38.79 v28.88,43.76 | v13.46,30.86 13.51,30.91 U9.10
  Bottom 0.203: v28.88,43.76 31.1,43.76 31.5,43.36 32.05,43.36 32.45,43.76 35.95,43.76 36.38,44.19 39.01,44.19 LCD1.12 | v18.11,38.96 19.15,37.92 20.01,37.92 21.43,36.49 21.43,35.95 20.82,35.33 17.93,35.33 v13.46,30.86
N$5  (via drill 0.35)
  Top 0.203: U9.11 17.53,32.18 v17.78,32.44 | v36.65,43.54 36.75,43.54 37.57,44.35 41.7,44.35 LCD1.13
  Bottom 0.203: v17.78,32.44 22.98,32.44 26.89,36.35 29.46,36.35 v36.65,43.54
N$6  (via drill 0.35)
  Top 0.203: v23.09,39.45 30.54,46.89 33.27,46.89 33.99,47.61 33.99,48.52 34.8,49.33 38.35,49.33 39.07,48.62 39.07,47.71 39.88,46.89 40.9,46.89 41.61,47.61 41.61,48.52 42.42,49.33 45.98,49.33 47.19,48.11 LCD1.14 | v19.76,33.66 15.88,33.66 U9.12
  Bottom 0.203: v23.09,39.45 23.09,36.98 v19.76,33.66
N$7
  Top 0.203: U9.4 7.32,35.41 7.91,35.41 19.37,46.87 20.59,46.87 21.83,48.11 LCD1.4
N$8
  Top 0.203: U9.5 7.32,34.14 7.91,34.14 8.09,34.32 8.09,34.91 19.64,46.46 22.72,46.46 24.37,48.11 LCD1.5
N$9
  Top 0.203: U9.6 7.32,32.87 7.91,32.87 8.09,33.05 8.09,33.64 18.85,44.41 23.2,44.41 26.91,48.11 LCD1.6
N$10
  Top 0.406: U1.5 96.56,45.24 C1.2
N$11
  Top 0.406: U8.7 33.42,32.14 33.74,31.82 33.74,30.36 Q3.3 32.44,29.05 C31.2
N$12
  Top 0.406: U8.8 34.98,32.13 Q3.1 36.04,30.04 36.04,28.58 35.23,27.77 C30.2
N$13
  Top 0.203: LCD1.3 19.23,47.27 | 19.23,47.27 19.2,47.27 | VR1.2 15.31,43.36 19.23,47.27
N$14
  Top 0.406: Q1.D 81.76,19.99 81.76,15.93 81.33,15.49 75.62,15.49 74.8,16.31 74.8,19.63 73.24,21.2 R5.1
  Top 3.302: Q1.D 79.43,22.33 J1.2
  Bottom 3.302: Q1.D 79.43,22.33 J1.2
N$15
  Top 0.203: 27.3,39.01 U8.26 27.25,39.06 28.04,39.06 28.45,38.66 28.45,35.66 29.64,34.52 33.48,34.52 33.86,34.14 34.34,34.14 34.8,33.67 34.8,33.03 36.55,31.28 36.55,29.66 42.37,23.84 43.81,23.84 44.84,22.81 C34.2 47.76,22.81 47.77,22.8 U10.2
N$16
  Top 0.254: U2.11 C25.2 R13.2
N$17
  Top 0.203: U7.6 21.39,8.59 21.39,7.9 20.12,7.9 19.11,8.9 R6.1
N$18
  Top 0.406: U3.6 81.73,40.14 81.33,40.54 78.04,40.54 R2.1
N$19
  Top 0.305: C24.1 U7.8
N$20
  Top 0.61: C23.1 21.14,7.29 18.31,7.29 17.37,8.23 J2.PWR | C23.1 C22.1 | U7.7 23.29,7.28 C23.1
N$21
  Top 0.305: C24.2 28.31,11.13 28.35,11.1
  Top 0.61: U7.1 24.57,14.09 L1.P$1 28.35,15.61 28.35,11.1 28.35,8.4 D1.C
N$22
  Top 0.305: U7.4 19.55,12.89 R4.1 17.11,14.25 R3.1
N$23
  Top 0.305: U7.3 R9.1
N$24
  Top 0.254: R2.2 74.85,40.62 U2.12
  Top 0.406: C16.2 R2.2
N$25
  Top 0.305: R9.2 21.82,18.02 C20.1
N$26
  Top 0.305: U6.1 50.39,40.13 50.94,39.58 R12.1 50.94,39.56 51.54,40.16 52.49,40.16 R7.2
N$27
  Top 0.305: R13.1 69.08,35.2 68.14,36.14 62.53,36.14 | 62.53,36.14 61.9,36.78 U5.7 | 62.53,36.14 61.9,35.51 U5.6
N$28
  Top 0.61: J4.2 2.83,17.76 Q2.2 2.88,21.14 5.6,21.14 6.43,21.97 D3.A
N$29
  Bottom 0.203: R35.1 83.88,4.62 S5.B 84.05,6.91 R36.1
N$30  (via drill 0.35)
  Top 0.203: 34.29,41.48 37.25,41.48 R18.1 | 34.29,41.48 U8.17 | v34.92,42.98 34.92,42.11 34.29,41.48
  Bottom 0.203: J3.3 3.99,43.64 5.21,42.42 6.22,42.42 6.78,42.98 v34.92,42.98
N$31  (via drill 0.35)
  Top 0.203: R19.1 37.94,39.99 U8.16 31.95,39.99 v31.8,40.13 | J3.1 4.5,44.86 4.5,43.13 5.31,42.32 6.22,42.32 6.73,41.81 v7.82,41.81
  Bottom 0.203: v31.8,40.13 30.85,40.13 30.01,40.97 8.66,40.97 v7.82,41.81
N$32  (via drill 0.35)
  Top 0.203: R22.1 37.24,38.2 36.47,38.97 35.93,38.97 U8.15 30.87,39.19 v30.5,39.55
  Bottom 0.203: v30.5,39.55 29.46,40.59 6.93,40.59 6.22,39.88 5.21,39.88 4.5,40.59 4.5,41.95 4.03,42.42 2.67,42.42 1.96,43.13 1.96,44.14 2.67,44.86 3.68,44.86 4.9,43.64 J3.4
N$33  (via drill 0.35)
  other vias: 76.73,36.02
N$34
  Top 0.203: U8.13 36.6,37.59 R23.1
N$35
  Top 0.203: U8.12 35.93,36.57 36.47,36.57 36.65,36.39 36.65,35.65 38.34,33.96 R24.1
N$36  (via drill 0.35)
  Top 0.305: U5.1 57.15,38.05 v58.47,36.73
  Top 0.406: C13.1 83.11,25.5 77.5,25.5 75.29,23.29 75.29,20.88 78.77,17.4 Q1.G
  Bottom 0.305: v58.47,36.73 59.44,36.73 63.97,32.19 68.12,32.19 68.84,31.47 68.84,27.32 Q1.G
N$37  (via drill 0.35)
  Top 0.254: R5.2 R11.1 70.2,23.14 D2.C 70.08,25.98 v70.08,30.96 | v66.57,33.63 65.96,34.24 U5.5
  Bottom 0.254: v70.08,30.96 67.41,33.63 v66.57,33.63
N$38
  Bottom 0.203: R33.1 83.88,11.73 S5.A 84.05,9.45 R37.1
N$39
  Top 0.305: U5.3 55.52,36.14 54.92,36.14 53.55,37.52 R12.2 51.95,36.62 50.94,35.61 R8.1
N$40  (via drill 0.35)
  Top 0.305: S1.A2 S1.A1 49.63,10.03 v49.63,9.37
  Bottom 0.305: R16.2 50.01,8.99 v49.63,9.37 48.95,8.69 R20.1
N$41  (via drill 0.35)
  Top 0.305: S3.A2 S3.A1 39.29,10.08 v39.29,9.35
  Bottom 0.305: R25.2 39.65,8.99 v39.29,9.35 39.29,8.83 R27.1
N$42
  Bottom 0.203: C35.2 94.77,9.54 R32.2 94.94,8.82 95.78,7.99 95.78,6.76 94.94,5.93 R34.1 S5.E
N$43  (via drill 0.35)
  Top 0.203: U8.2 29.2,32.68 29.2,31.93 28.02,30.87 v28.02,30.1
  Bottom 0.203: R16.1 52.62,8.99 51.56,10.06 48.09,10.06 v28.02,30.1
  Bottom 0.305: C26.1 52.84,7.14 R16.1
N$44  (via drill 0.35)
  Top 0.203: U8.32 27.13,33.45 25.68,32 25.68,28.19 v25.91,27.96
  Bottom 0.203: v25.91,27.96 25.91,2.95 27.15,1.65 27.3,1.51 85.19,1.51 88.09,4.41 98.15,4.41 98.62,4.8 98.62,6.51 98.63,6.91 98.63,7.35 R32.1
N$45
  cutout Top: 73.96,38.81 86.44,38.81 86.41,36.73 87.68,35.46 90.22,35.46 92.3,34.01 92.33,16.97 92.33,14.43 74.88,14.43 73.96,15.14
N$46  (via drill 0.35)
  Top 0.203: v26.77,29.13 26.77,31.01 U8.1
  Bottom 0.203: R25.1 42.56,13.37 v26.77,29.13
  Bottom 0.305: C28.1 42.56,7.14 R25.1
N$47  (via drill 0.35)
  other vias: 78.41,36.04
N$48  (via drill 0.35)
  Top 0.305: S4.A2 S4.A1 59.89,9.99 v59.89,9.3
  Bottom 0.305: R26.2 60.2,8.99 v59.89,9.3 59.11,8.51 R28.1
N$49  (via drill 0.35)
  other vias: 78.41,34.54
N$50
  cutout Bottom: 85.95,38.79 86.44,38.79 86.41,36.73 87.68,35.46 90.22,35.46 92.3,34.01 92.33,16.97 92.35,14.43 74.88,14.43 73.96,15.14 73.96,38.81 74.8,38.81
N$51  (via drill 0.35)
  Top 0.305: S2.A2 S2.A1 70.18,9.99 v70.18,9.42
  Bottom 0.305: R17.2 70.61,8.99 v70.18,9.42 69.44,8.69 R21.1
N$52  (via drill 0.35)
  Top 0.203: v36.2,32.69 36.2,33.9 U8.9
  Bottom 0.203: R17.1 73.2,8.99 72.08,10.11 69.28,10.11 63.81,4.63 60.76,4.63 60.58,4.81 60.58,7.26 56.86,7.26 36.66,27.59 36.66,32.23 v36.2,32.69
  Bottom 0.305: C27.1 73.42,7.14 R17.1
N$53  (via drill 0.35)
  other vias: 87.81,32.92
N$54  (via drill 0.35)
  other vias: 86.59,34.14
N$55  (via drill 0.35)
  Top 0.203: U8.10 35.95,34.94 36.46,34.94 37.31,34.09 37.31,30.33 v38.3,29.34
  Bottom 0.203: R26.1 60.49,11.63 54.74,11.63 51.91,14.34 51.91,25.76 51.02,26.59 49.02,26.59 46.84,28.78 38.86,28.78 v38.3,29.34
  Bottom 0.305: C29.1 63.13,7.14 R26.1
N$56  (via drill 0.35)
  other vias: 85.39,35.33
N$57  (via drill 0.35)
  other vias: 84.89,33.81
N$59  (via drill 0.35)
  other vias: 87.27,31.42
N$60  (via drill 0.35)
  other vias: 86.08,32.61
N$61  (via drill 0.35)
  other vias: 83.67,35.03
N$62  (via drill 0.35)
  other vias: 78.41,33.05
N$63  (via drill 0.35)
  other vias: 78.41,31.55
N$64  (via drill 0.35)
  other vias: 76.73,31.65
N$65  (via drill 0.35)
  other vias: 76.73,33.1
N$66  (via drill 0.35)
  other vias: 76.73,34.56
RESET  (via drill 0.35)
  Top 0.203: U8.29 27.02,36.68 25.98,36.68 25.54,36.23 R31.2 20.79,36.23 v20.78,36.22
  Bottom 0.203: J3.5 5.64,38.63 11.29,38.63 11.92,38 11.92,36.37 17.31,36.37 17.58,36.65 18.13,36.65 18.56,36.22 v20.78,36.22
ROTARY_A  (via drill 0.35)
  Top 0.203: U8.23 29.66,41.24 29.66,39.46 32.41,36.71 v32.41,35.31
  Bottom 0.203: C33.1 87.67,11.73 R33.2 86.4,11.73 85.57,12.56 54.88,12.56 52.72,14.73 52.72,30.46 51.59,31.6 38.22,31.6 36.47,33.35 34.37,33.35 v32.41,35.31
ROTARY_B  (via drill 0.35)
  Top 0.203: U8.24 28.62,39.03 28.83,38.82 28.83,36.5 v30.07,35.26 | v37.31,25.48 39.8,25.48 v39.9,25.37 | v46.69,27.48 51.23,27.48 v51.33,27.38
  Bottom 0.203: C36.1 87.67,4.62 R35.2 86.4,4.62 85.57,3.79 77.77,3.79 77.74,3.82 75.39,6.2 75.39,10.03 73.21,12.18 54.73,12.18 52.34,14.57 52.34,26.38 v51.33,27.38 | v30.07,35.26 30.07,32.72 v37.31,25.48 | v39.9,25.37 44.58,25.37 v46.69,27.48
SCLK  (via drill 0.35)
  Top 0.305: U2.3 67.05,38.9 67.05,39.67 66.49,40.23 v63.4,40.23 | v43.41,40.31 41.15,42.57 R18.2 | v44.88,37.36 44.88,35.94 44.86,35.92 44.86,35.43 U6.5
  Bottom 0.305: v63.4,40.23 63.32,40.31 v43.41,40.31 43.41,38.84 v44.88,37.36
VREF  (via drill 0.35)
  Top 0.203: C19.2 45.45,42.8 44.27,43.98 42.44,43.98 42.11,43.65 37.58,43.65 37.41,43.49 37.41,43.37 36.92,42.88 36.38,42.88 35.99,43.26 35.99,44.17 v35.64,44.53 | v31.77,44.02 31.77,41.52 U8.20
  Top 0.406: C2.2 93.4,47.54 U1.6 93.4,43.66 93.29,43.56 89.41,43.56 C3.2 87.46,45.51 83.41,45.51 79.04,49.89 75.06,49.89 | 75.06,49.89 59.38,49.89 54.15,44.65 50.67,44.65 48.82,42.8 C19.2 U6.3 | 75.06,49.89 C8.2 71.72,46.54 U2.15
  Bottom 0.203: v35.64,44.53 32.28,44.53 v31.77,44.02

### Text on the board
Bottom: R170911
tPlace: V+
bPlace: Electronic Load / By XJ / 2017.09